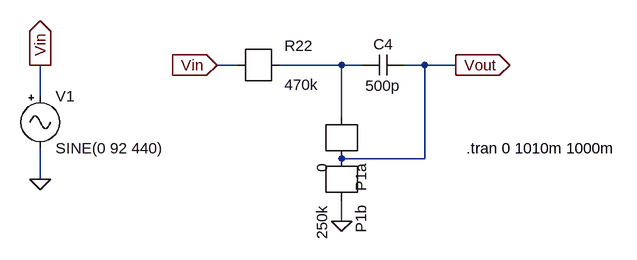
[diagram p0: schematic gain.asc]
gain.asc, the LTspice schematic file:
Version 4
SHEET 1 1000 680
WIRE 160 192 128 192
WIRE 320 192 224 192
WIRE 352 192 320 192
WIRE 448 192 416 192
WIRE 496 192 448 192
WIRE -144 240 -144 192
WIRE 320 272 320 192
WIRE 448 336 448 192
WIRE 448 336 320 336
WIRE -144 368 -144 320
WIRE 320 432 320 400
FLAG -144 192 Vin
IOPIN -144 192 Out
FLAG 128 192 Vin
IOPIN 128 192 In
FLAG -144 368 0
FLAG 320 432 0
FLAG 496 192 Vout
IOPIN 496 192 Out
SYMBOL signal -144 224 R0
SYMATTR InstName V1
SYMATTR Value SINE(0 92 440)
SYMBOL r 160 192 R0
SYMATTR InstName R22
SYMATTR Value 470k
SYMBOL r 320 272 R90
SYMATTR InstName P1a
SYMATTR Value 0
SYMBOL r 320 336 R90
SYMATTR InstName P1b
SYMATTR Value 250k
SYMBOL cap 416 176 R90
WINDOW 0 0 32 VBottom 2
WINDOW 3 32 32 VTop 2
SYMATTR InstName C4
SYMATTR Value 500p
TEXT 512 320 Left 2 !.tran 0 1010m 1000m

The netlist it stands for:
* gain.asc
V1 Vin 0 SINE(0 92 440)
R22 N001 Vin 470k
R§P1a Vout N001 0
R§P1b 0 Vout 250k
C4 Vout N001 500p
.tran 0 1010m 1000m
.backanno
.end